# Altium schematic sheet 2_Non_Volatile_Memories.SchDoc
size A4; Organization: SpaceLab UFSC; Address1: UFSC - SpaceLab; Address2: University Campus - Trindade; Address3: Dep. of Electrical Engineering - CTC; Address4: Florianópolis, Santa Catarina, Brazil; DocumentNumber: 3; SheetNumber: 3; SheetTotal: 4; Address5: CEP: 88040 - 900
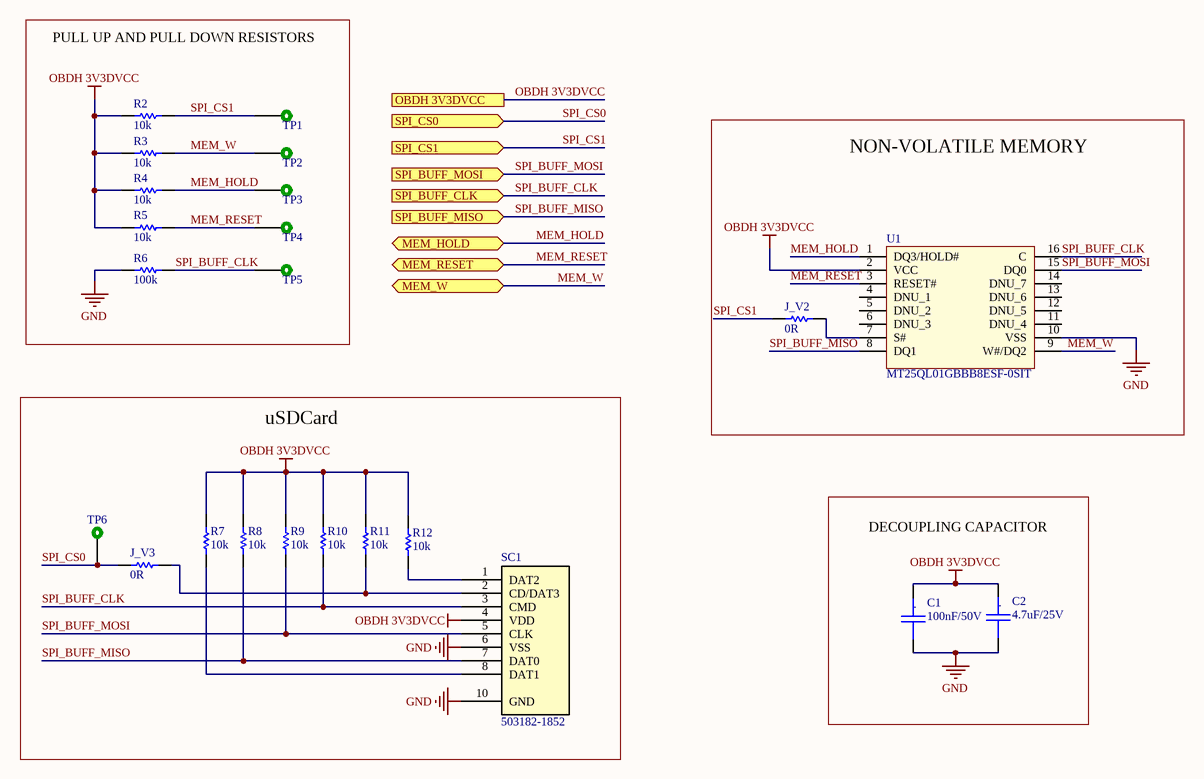
[diagram p0: 2_Non_Volatile_Memories.SchDoc]

## Parts
C1  100nF/50V  [C0603_MD]
C2  4.7uF/25V  [C0805_MD]
J_V2  0R  [0805]
J_V3  0R  [0805]
R2  10k  [0805]
R3  10k  [0805]
R4  10k  [0805]
R5  10k  [0805]
R6  100k  [0805]
R7  10k  [0805]
R8  10k  [0805]
R9  10k  [0805]
R10  10k  [0805]
R11  10k  [0805]
R12  10k  [0805]
SC1  MicroSD Card Connector  [USD_CARD]  (value not drawn)
TP1  TEST_POINT_2  [TEST_POINT_2]  (value not drawn)  (no BOM)
TP2  TEST_POINT_2  [TEST_POINT_2]  (value not drawn)  (no BOM)
TP3  TEST_POINT_2  [TEST_POINT_2]  (value not drawn)  (no BOM)
TP4  TEST_POINT_2  [TEST_POINT_2]  (value not drawn)  (no BOM)
TP5  TEST_POINT_2  [TEST_POINT_2]  (value not drawn)  (no BOM)
TP6  TEST_POINT_2  [TEST_POINT_2]  (value not drawn)  (no BOM)
U1  MT25QL01GBBB8ESF-0SIT  [SOIC127P1032X265-16N]

## Blocks framed on the sheet
PULL UP AND PULL DOWN RESISTORS: R2-R6 TP1-TP5
NON-VOLATILE MEMORY: J_V2 U1
uSDCard: J_V3 R7-R12 SC1 TP6
DECOUPLING CAPACITOR: C1 C2

## Ports
MEM_HOLD (bidir), MEM_RESET (bidir), MEM_W (bidir), OBDH 3V3DVCC, SPI_BUFF_CLK (in), SPI_BUFF_MISO (in), SPI_BUFF_MOSI (in), SPI_CS0 (in), SPI_CS1 (in)

## Nets
GND: C1.2 C2.2 R6.2 SC1.6(VSS) SC1.10(GND) U1.10(VSS)
OBDH 3V3DVCC: C1.1 C2.1 R2.2 R3.2 R4.2 R5.2 R7.2 R8.2 R9.2 R10.2 R11.2 R12.2 SC1.4(VDD) U1.2(VCC) ; port OBDH 3V3DVCC
MEM_HOLD: R4.1 TP3.1 U1.1(DQ3/HOLD#) ; port MEM_HOLD
MEM_RESET: R5.1 TP4.1 U1.3(RESET#) ; port MEM_RESET
MEM_W: R3.1 TP2.1 U1.9(W#/DQ2) ; port MEM_W
SPI_BUFF_CLK: R6.1 R10.1 SC1.3(CMD) TP5.1 U1.16(C) ; port SPI_BUFF_CLK
SPI_BUFF_MISO: R8.1 SC1.7(DAT0) U1.8(DQ1) ; port SPI_BUFF_MISO
SPI_BUFF_MOSI: R9.1 SC1.5(CLK) U1.15(DQ0) ; port SPI_BUFF_MOSI
SPI_CS0: J_V3.2 TP6.1 ; port SPI_CS0
SPI_CS1: J_V2.2 R2.1 TP1.1 ; port SPI_CS1
NetJ_V2_1: J_V2.1 U1.7(S#)
NetJ_V3_1: J_V3.1 R11.1 SC1.2(CD/DAT3)
NetR7_1: R7.1 SC1.8(DAT1)
NetR12_1: R12.1 SC1.1(DAT2)

Not connected (* = marked no-connect by the designer): U1 4(DNU_1) 5(DNU_2) 6(DNU_3) 11(DNU_4) 12(DNU_5) 13(DNU_6) 14(DNU_7)

## Notes on the sheet
- Date:
- Title:
- Size:
- A4
- Project:
- Time:
- Sheet
- of
- Revision:
- UFSC - SpaceLab
- University Campus - Trindade
- Dep. of Electrical Engineering - CTC
- Florianópolis, Santa Catarina, Brazil
- CEP: 88040 - 900
- Drawn By:
- Model:
- (in symbol Cap_Cer_X7R_4.7uF_25V_0805) .
- (in symbol Cap_Cer_X7R_100nF_50V_0603) .

## Library data of the parts
C1 = Cap_Cer_X7R_100nF_50V_0603: CAP CER 100nF 50V 0603 10%; Partnumber: C0603C104K5RAC3121; Manufacturer: Yageo; Manufacturer Part Number: CC0201KRX7R9BB101; Capacitance: 100pF; Dielectric: X7R; NCM: 8532.24.10; Case/Package: 0201; Case Code (Imperial): 0201; Case Code (Metric): 0603; ComponentLink1Description: https://www.digikey.com/product-detail/en/yageo/CC0201KRX7R9BB101/311-1401-1-ND/2833707; ComponentLink1URL: https://www.digikey.com/product-detail/en/yageo/CC0201KRX7R9BB101/311-1401-1-ND/2833707; ComponentLink2Description: https://br.mouser.com/ProductDetail/Yageo/CC0201KRX7R9BB101?qs=%2Fha2pyFaduiYipKOFrxfqt3%252B9aGSfhofiweIoBBppi5CkwQHqUahpQ%3D%3D; ComponentLink2URL: https://br.mouser.com/ProductDetail/Yageo/CC0201KRX7R9BB101?qs=%2Fha2pyFaduiYipKOFrxfqt3%252B9aGSfhofiweIoBBppi5CkwQHqUahpQ%3D%3D; ComponentLink3Description: http://www.yageo.com/documents/recent/UPY-GPHC_X7R_6.3V-to-50V_18.pdf?src-supplier=Digi-Key; ComponentLink3URL: http://www.yageo.com/documents/recent/UPY-GPHC_X7R_6.3V-to-50V_18.pdf?src-supplier=Digi-Key; ComponentLink4Description: http://www.yageo.com/documents/recent/UPY-GPHC_X7R_6.3V-to-50V_8.pdf?src-supplier=Avnet+Europe; ComponentLink4URL: http://www.yageo.com/documents/recent/UPY-GPHC_X7R_6.3V-to-50V_8.pdf?src-supplier=Avnet+Europe; ComponentLink5Description: http://www.yageo.com/documents/recent/UPY-GPHC_X7R_6.3V-to-50V_8.pdf?src-supplier=Avnet; ComponentLink5URL: http://www.yageo.com/documents/recent/UPY-GPHC_X7R_6.3V-to-50V_8.pdf?src-supplier=Avnet; ComponentLink6Description: http://www.mouser.com/ds/2/447/Yageo_UPY-GP_NP0_16V-to-50V_9-358835.pdf?src-supplier=Mouser; ComponentLink6URL: http://www.mouser.com/ds/2/447/Yageo_UPY-GP_NP0_16V-to-50V_9-358835.pdf?src-supplier=Mouser; Composition: Ceramic; Depth: 0.3mm; Halogen Free: Halogen Free; Height: 0.3mm; Lead Free: Lead Free; Length: 0.6mm; Max Operating Temperature: 125°C; Min Operating Temperature: -55°C; Mount: Surface Mount; Package Quantity: 1; Packaging: Tape and Reel; Pricing 1: 1=0.1, 10=0.017, 100=0.0078, 500=0.00554, 1000=0.00436, 2500=0.00396, 5000=0.00364 (USD); Pricing 2: 1=0.1, 10=0.024, 100=0.011, 1000=0.009, 2500=0.006, 10000=0.006 (USD); Radiation Hardening: No; Stock 1: 203642; Stock 2: 51204; Supplier 1: Digi-Key; Supplier 2: Mouser; Supplier Part Number 1: 311-1401-1-ND; Supplier Part Number 2: 603-CC201KRX7R9BB101; Termination: SMD/SMT; Thickness: 0.013inch; Tolerance: 10%; Voltage Rating (DC): 50V; Voltage Rating: 50V; Weight: 6E-06oz; Width: 0.012inch
C2 = Cap_Cer_X7R_4.7uF_25V_0805: CAP CER 4.7UF 25V 10% X7R 0805; Partnumber: C0805C475K3RACAUTO; Manufacturer: Taiyo Yuden; Manufacturer Part Number: TMK212AB7475KG-T; NCM: 8532.24.10; Capacitance: 4.7uF; Case/Package: 0805; Case Code (Imperial): 0805; Case Code (Metric): 2012; ComponentLink1Description: https://www.digikey.com/product-detail/en/taiyo-yuden/TMK212AB7475KG-T/587-2990-2-ND/2714168; ComponentLink1URL: https://www.digikey.com/product-detail/en/taiyo-yuden/TMK212AB7475KG-T/587-2990-2-ND/2714168; ComponentLink2Description: https://br.mouser.com/ProductDetail/Taiyo-Yuden/TMK212AB7475KG-T?qs=%2Fha2pyFaduhOmvqoBXaf2AOtUPA8upoo0e72F1hCYb1lacT8UkHI0g%3D%3D; ComponentLink2URL: https://br.mouser.com/ProductDetail/Taiyo-Yuden/TMK212AB7475KG-T?qs=%2Fha2pyFaduhOmvqoBXaf2AOtUPA8upoo0e72F1hCYb1lacT8UkHI0g%3D%3D; ComponentLink3Description: https://www.yuden.co.jp/productdata/catalog/mlcc_all_e.pdf?src-supplier=Digi-Key; ComponentLink3URL: https://www.yuden.co.jp/productdata/catalog/mlcc_all_e.pdf?src-supplier=Digi-Key; ComponentLink4Description: http://www.yuden.co.jp/ut/product/category/capacitor/TMK212AB7475KG-T.pdf?src-supplier=Avnet; ComponentLink4URL: http://www.yuden.co.jp/ut/product/category/capacitor/TMK212AB7475KG-T.pdf?src-supplier=Avnet; ComponentLink5Description: http://www.farnell.com/datasheets/1481447.pdf?src-supplier=Element14; ComponentLink5URL: http://www.farnell.com/datasheets/1481447.pdf?src-supplier=Element14; ComponentLink6Description: http://www.onlinecomponents.com/productFiles/mf-TAI/461tmk212ab7475kg-t.pdf?src-supplier=Onlinecomponents.com; ComponentLink6URL: http://www.onlinecomponents.com/productFiles/mf-TAI/461tmk212ab7475kg-t.pdf?src-supplier=Onlinecomponents.com; Composition: Ceramic; Depth: 1.25mm; Dielectric: X7R; Height: 1.25mm; Length: 2mm; Max Operating Temperature: 125°C; Min Operating Temperature: -55°C; Mount: Surface Mount; Number of Pins: 2; Package Quantity: 1; Packaging: Tape and Reel; Pricing 1: 1=0.35, 10=0.243, 100=0.1376, 500=0.09716, 1000=0.08501 (USD); Pricing 2: 1=0.27, 10=0.124, 100=0.083, 500=0.074, 1000=0.065, 3000=0.054 (USD); Radiation Hardening: No; REACH SVHC: Unknown; Stock 1: 1594936; Stock 2: 326053; Supplier 1: Digi-Key; Supplier 2: Mouser; Supplier Part Number 1: 587-2990-6-ND; Supplier Part Number 2: 963-TMK212AB7475KG-T; Termination: SMD/SMT; Thickness: 0.053inch; Tolerance: 10%; Voltage Rating (DC): 25V; Voltage Rating: 25V; Width: 0.049inch
J_V2 J_V3 = RC0805JR-070RL: RES 0R OHM 1/8W JUMPER 0805; Partnumber: CRCW08050000Z0EA; Manufacturer: Yageo; Resistance: 0mR; Tolerance: 5%; Power Rating: 125mW; Voltage Rating: 150V; Temperature Coefficient: 200ppm/°C; NCM: 8533.21.20; Supplier 1: Digi-Key; Supplier Part Number 1: 311-0.0ARCT-ND; Stock 1: 10579520; Pricing 1: 1=0.1, 10=0.035, 25=0.0248, 50=0.019, 100=0.014, 250=0.01072, 500=0.00856, 1000=0.00631 (USD); Case/Package: 0805; Number of Pins: 2; Contact Plating: Tin,Matte; Case Code (Imperial): 0805; Case Code (Metric): 2012; Min Operating Temperature: -55°C; Max Operating Temperature: 155°C; Composition: Thick Film; Packaging: Tape and Reel; Voltage Rating (DC): 150V; Termination: SMD/SMT; Military Standard: Not; Length: 2mm; Height: 0.5mm; Width: 1.25mm; Depth: 1.25mm; Radiation Hardening: No; REACH SVHC: Unknown; Lead Free: Lead Free; ComponentLink1URL: http://www.farnell.com/datasheets/2167052.pdf?src-supplier=Element14; ComponentLink1Description: http://www.farnell.com/datasheets/2167052.pdf?src-supplier=Element14; ComponentLink2URL: http://documents.rs-components.com/techlib://itc_doclist_GB.htm?stockno=6185129&src-supplier=RSComponents; ComponentLink2Description: http://documents.rs-components.com/techlib://itc_doclist_GB.htm?stockno=6185129&src-supplier=RSComponents; ComponentLink3URL: https://www.verical.com/server-webapp/html/getDatasheet?partID=330685&src-supplier=Verical; ComponentLink3Description: https://www.verical.com/server-webapp/html/getDatasheet?partID=330685&src-supplier=Verical; Supplier 2: Mouser; Supplier Part Number 2: 603-RC0805JR-070RL; Stock 2: 658275; Pricing 2: 1=0.1, 10=0.005, 100=0.005, 1000=0.005, 5000=0.004, 10000=0.004 (USD); Manufacturer Part Number: RC0805JR-070RL
R2-R5 R7-R12 = R10k_1%_1/8W_0805: RES 10K OHM 1/8W 1%  0805; Partnumber: CRCW080510K0FKEA; Manufacturer: Vishay; Power Rating: 125mW; Resistance: 10kR; Temperature Coefficient: 100ppm/°C; Voltage Rating (DC): 150V; NCM: 8533.21.20; Case/Package: 0805; Case Code (Imperial): 0805; Case Code (Metric): 2012; ComponentLink1Description: https://www.digikey.com/product-detail/en/vishay-dale/CRCW080510K0FKEA/541-10-0KCCT-ND/1180897; ComponentLink1URL: https://www.digikey.com/product-detail/en/vishay-dale/CRCW080510K0FKEA/541-10-0KCCT-ND/1180897; ComponentLink2Description: https://br.mouser.com/ProductDetail/Vishay-Dale/CRCW080510K0FKEA?qs=sGAEpiMZZMu61qfTUdNhG2DpbjADlD3GOIdKSeOTyFU%3D; ComponentLink2URL: https://br.mouser.com/ProductDetail/Vishay-Dale/CRCW080510K0FKEA?qs=sGAEpiMZZMu61qfTUdNhG2DpbjADlD3GOIdKSeOTyFU%3D; ComponentLink3Description: http://www.mouser.com/ds/2/427/dcrcwe3-109170.pdf?src-supplier=Mouser; ComponentLink3URL: http://www.mouser.com/ds/2/427/dcrcwe3-109170.pdf?src-supplier=Mouser; ComponentLink4Description: http://uk.rs-online.com/webdocs/0d98/0900766b80d98b26.pdf?src-supplier=RSComponents; ComponentLink4URL: http://uk.rs-online.com/webdocs/0d98/0900766b80d98b26.pdf?src-supplier=RSComponents; ComponentLink5Description: http://www.alliedelec.com/m/d/0c934d6939ccefa68dbe0b96d821c8cf.pdf?src-supplier=Allied+Electronics; ComponentLink5URL: http://www.alliedelec.com/m/d/0c934d6939ccefa68dbe0b96d821c8cf.pdf?src-supplier=Allied+Electronics; ComponentLink6Description: http://www.vishay.com/docs/20035/dcrcwe3.pdf?src-supplier=Avnet+Asia; ComponentLink6URL: http://www.vishay.com/docs/20035/dcrcwe3.pdf?src-supplier=Avnet+Asia; ComponentLink7Description: http://www.vishay.com/docs/20035/dcrcwe3.pdf?src-supplier=Avnet+Europe; ComponentLink7URL: http://www.vishay.com/docs/20035/dcrcwe3.pdf?src-supplier=Avnet+Europe; ComponentLink8Description: http://www.farnell.com/datasheets/2310790.pdf?src-supplier=Element14; ComponentLink8URL: http://www.farnell.com/datasheets/2310790.pdf?src-supplier=Element14; ComponentLink9Description: http://www.vishay.com/docs/20035/dcrcwe3.pdf?src-supplier=Avnet; ComponentLink9URL: http://www.vishay.com/docs/20035/dcrcwe3.pdf?src-supplier=Avnet; ComponentLink10Description: http://www.vishay.com/docs/20035/dcrcwe3.pdf?src-supplier=Future+Electronics; ComponentLink10URL: http://www.vishay.com/docs/20035/dcrcwe3.pdf?src-supplier=Future+Electronics; Composition: Thick Film; Contact Plating: Tin; Depth: 1.25mm; Height: 0.45mm; Lead Free: Lead Free; Length: 2mm; Manufacturer Part Number: CRCW080510K0FKEA; Max Operating Temperature: 155°C; Military Standard: Not; Min Operating Temperature: -55°C; Package Quantity: 5000; Packaging: Tape and Reel; Pricing 1: 1=0.1, 10=0.062, 100=0.0254, 1000=0.01142, 2500=0.00991 (USD); Pricing 2: 1=0.1, 10=0.062, 100=0.025, 1000=0.01, 5000=0.007, 10000=0.006 (USD); Radiation Hardening: No; REACH SVHC: Unknown; Stock 1: 1478098; Stock 2: 157494; Supplier 1: Digi-Key; Supplier 2: Mouser; Supplier Part Number 1: 541-10.0KCCT-ND; Supplier Part Number 2: 71-CRCW0805-10K-E3; Termination: SMD/SMT; Tolerance: 1%; Voltage Rating: 150V; Weight: 0.000194oz; Width: 1.25mm
R6 = R100k_1%_1/8W_0805: RES 100K OHM 1/8W 1% 0805; Partnumber: AC0805FR-13100KL; Manufacturer: Yageo; Manufacturer Part Number: RC0805FR-07100KL; Max Power Dissipation: 125mW; Resistance: 100kR; Temperature Coefficient: 100ppm/°C; Voltage Rating (DC): 150V; NCM: 8533.21.20; Case/Package: 0805; Case Code (Imperial): 0805; Case Code (Metric): 2012; ComponentLink1Description: https://www.digikey.com/product-detail/en/yageo/RC0805FR-07100KL/311-100KCRCT-ND/730491; ComponentLink1URL: https://www.digikey.com/product-detail/en/yageo/RC0805FR-07100KL/311-100KCRCT-ND/730491; ComponentLink2Description: https://br.mouser.com/ProductDetail/Yageo/RC0805FR-07100KL?qs=%2Fha2pyFadugqH4HCO4lefXR2vnSIcQedeLFD%252BIWbuSwm%252BtiKkObUBg%3D%3D; ComponentLink2URL: https://br.mouser.com/ProductDetail/Yageo/RC0805FR-07100KL?qs=%2Fha2pyFadugqH4HCO4lefXR2vnSIcQedeLFD%252BIWbuSwm%252BtiKkObUBg%3D%3D; ComponentLink3Description: http://www.yageo.com/documents/recent/PYu-RC_Group_51_RoHS_L_10.pdf?src-supplier=Digi-Key; ComponentLink3URL: http://www.yageo.com/documents/recent/PYu-RC_Group_51_RoHS_L_10.pdf?src-supplier=Digi-Key; ComponentLink4Description: http://www.yageo.com/documents/recent/PYu-RC_Group_51_RoHS_L_9.pdf?src-supplier=Mouser; ComponentLink4URL: http://www.yageo.com/documents/recent/PYu-RC_Group_51_RoHS_L_9.pdf?src-supplier=Mouser; ComponentLink5Description: http://documents.rs-components.com/techlib://itc_doclist_GB.htm?stockno=6185113&src-supplier=RSComponents; ComponentLink5URL: http://documents.rs-components.com/techlib://itc_doclist_GB.htm?stockno=6185113&src-supplier=RSComponents; ComponentLink6Description: http://www.yageo.ru/pdf/RC0805.pdf?src-supplier=Future+Electronics; ComponentLink6URL: http://www.yageo.ru/pdf/RC0805.pdf?src-supplier=Future+Electronics; ComponentLink7Description: http://www.farnell.com/datasheets/38627.pdf?src-supplier=Element14; ComponentLink7URL: http://www.farnell.com/datasheets/38627.pdf?src-supplier=Element14; ComponentLink8Description: http://www.farnell.com/datasheets/2167052.pdf?src-supplier=Element14; ComponentLink8URL: http://www.farnell.com/datasheets/2167052.pdf?src-supplier=Element14; ComponentLink9Description: http://www.farnell.com/datasheets/1686128.pdf?src-supplier=Element14; ComponentLink9URL: http://www.farnell.com/datasheets/1686128.pdf?src-supplier=Element14; ComponentLink10Description: http://www.farnell.com/datasheets/444164.pdf?src-supplier=Element14; ComponentLink10URL: http://www.farnell.com/datasheets/444164.pdf?src-supplier=Element14; Composition: Thick Film; Depth: 1.25mm; Features: Moisture Resistant; Height: 0.024inch; Lead Free: Lead Free; Lead Pitch: 0.4mm; Length: 2mm; Max Operating Temperature: 155°C; Military Standard: Not; Min Operating Temperature: -55°C; Number of Pins: 2; Number of Terminations: 2; Package Quantity: 1; Packaging: Tape and Reel; Power Rating: 125mW; Pricing 1: 1=0.1, 10=0.04, 100=0.0163, 1000=0.00731, 2500=0.00635 (USD); Pricing 2: 1=0.13, 10=0.031, 100=0.011, 1000=0.008, 5000=0.005, 10000=0.005 (USD); REACH SVHC: Unknown; Stock 1: 5685931; Stock 2: 2067874; Supplier 1: Digi-Key; Supplier 2: Mouser; Supplier Part Number 1: 311-100KCRCT-ND; Supplier Part Number 2: 603-RC0805FR-07100KL; Termination: SMD/SMT; Tolerance: 1%; Voltage Rating: 150V; Width: 0.049inch
SC1 = 503182-1852: MOLEX - 503182-1852 - Micro SD Normal UltraLowPro8CktEmbsTpPkg RoHS Compliant: Yes; Gender: Male; Number of Circuits: 8; Pitch: 1.1mm; Supplier 1: Digi-Key; Supplier Part Number 1: WM12834CT-ND; Manufacturer: Molex; Stock 1: 15724; Pricing 1: 1=2.45, 10=2.224, 25=2.0884, 50=1.9974, 100=1.9067, 250=1.72508, 500=1.5889 (USD); Mount: Surface Mount; Contact Material: Copper Alloy; Contact Plating: Gold; Housing Material: Polymer; Min Operating Temperature: -25°C; Max Operating Temperature: 85°C; Number of Rows: 1; Package Quantity: 1600; Packaging: Tape and Reel; Connector Type: Connector; Termination: Solder; Orientation: Right Angle; Length: 15.2mm; Depth: 14.95mm; REACH SVHC: No SVHC; Halogen Free: Low Halogen; ComponentLink1URL: https://www.molex.com/pdm_docs/sd/5031821852_sd.pdf?src-supplier=Digi-Key; ComponentLink1Description: https://www.molex.com/pdm_docs/sd/5031821852_sd.pdf?src-supplier=Digi-Key; ComponentLink2URL: http://www.farnell.com/datasheets/2701359.pdf?src-supplier=Element14; ComponentLink2Description: http://www.farnell.com/datasheets/2701359.pdf?src-supplier=Element14; ComponentLink3URL: http://www.farnell.com/datasheets/2701359.pdf?src-supplier=Farnell; ComponentLink3Description: http://www.farnell.com/datasheets/2701359.pdf?src-supplier=Farnell; ComponentLink4URL: http://www.molex.com/pdm_docs/sd/5031821852_sd.pdf?src-supplier=Digi-Key; ComponentLink4Description: http://www.molex.com/pdm_docs/sd/5031821852_sd.pdf?src-supplier=Digi-Key; ComponentLink5URL: http://components.arrow.com/part/dataview/0323_07103516?src-supplier=Arrow+Europe; ComponentLink5Description: http://components.arrow.com/part/dataview/0323_07103516?src-supplier=Arrow+Europe; ComponentLink6URL: http://www.farnell.com/datasheets/2701359.pdf?src-supplier=Newark; ComponentLink6Description: http://www.farnell.com/datasheets/2701359.pdf?src-supplier=Newark; Supplier 2: Mouser; Supplier Part Number 2: 538-503182-1852; Stock 2: 10562; Pricing 2: 1=2.22, 10=1.81, 100=1.56, 500=1.44, 1000=1.23, 1600=1.15, 4800=1.07, 9600=1.03, 24000=1 (USD); Manufacturer Part Number: 503182-1852
TP1-TP6 = TEST_POINT_2: Test point
U1 = MT25QL01GBBB8ESF-0SIT (2): NOR Flash Serial-SPI 3V 1Gbit 1024M/512M/256M x 1bit/2bit/4bit 6ns 16-Pin SOP-II; Manufacturer: Micron Technology; Interface: SPI,Serial; Min Supply Voltage: 2.7V; Density: 1Gb; Max Supply Voltage: 3.6V; Page Size: 256B; Supplier 1: Digi-Key; Supplier Part Number 1: 557-1789-ND; Stock 1: 1351; Pricing 1: 1=10.53, 10=9.755, 25=9.534, 50=9.4818, 100=8.3474, 250=7.9344, 500=7.85296, 1000=7.59119 (USD); Mount: Surface Mount; Case/Package: SOP; Number of Pins: 16; Contact Plating: Tin,Matte; Min Operating Temperature: -40°C; Max Operating Temperature: 85°C; Memory Type: NOR; Operating Supply Voltage: 3V; Access Time: 6ns; ComponentLink1URL: https://www.micron.com/~/media/documents/products/data-sheet/nor-flash/serial-nor/mt25q/die-rev-b/mt25q_qlkt_l_01g_bbb_0.pdf?src-supplier=Digi-Key; ComponentLink1Description: https://www.micron.com/~/media/documents/products/data-sheet/nor-flash/serial-nor/mt25q/die-rev-b/mt25q_qlkt_l_01g_bbb_0.pdf?src-supplier=Digi-Key; ComponentLink2URL: http://www.micron.com/~/media/documents/products/data-sheet/nor-flash/serial-nor/mt25q/mt25q_qlkt_l_01g_bbb_0.pdf?src-supplier=Avnet+Asia; ComponentLink2Description: http://www.micron.com/~/media/documents/products/data-sheet/nor-flash/serial-nor/mt25q/mt25q_qlkt_l_01g_bbb_0.pdf?src-supplier=Avnet+Asia; Supplier 2: Mouser; Supplier Part Number 2: 340-278808-TRAY; Stock 2: 2389; Pricing 2: 1=12, 10=11.04, 25=10.81, 50=10.77, 100=9.67, 250=9.37, 500=8.91, 1000=8.6, 2000=7.97 (USD); Manufacturer Part Number: MT25QL01GBBB8ESF-0SIT